# EAGLE design pc_heartypatch_v2 (EAGLE 6.6.0)
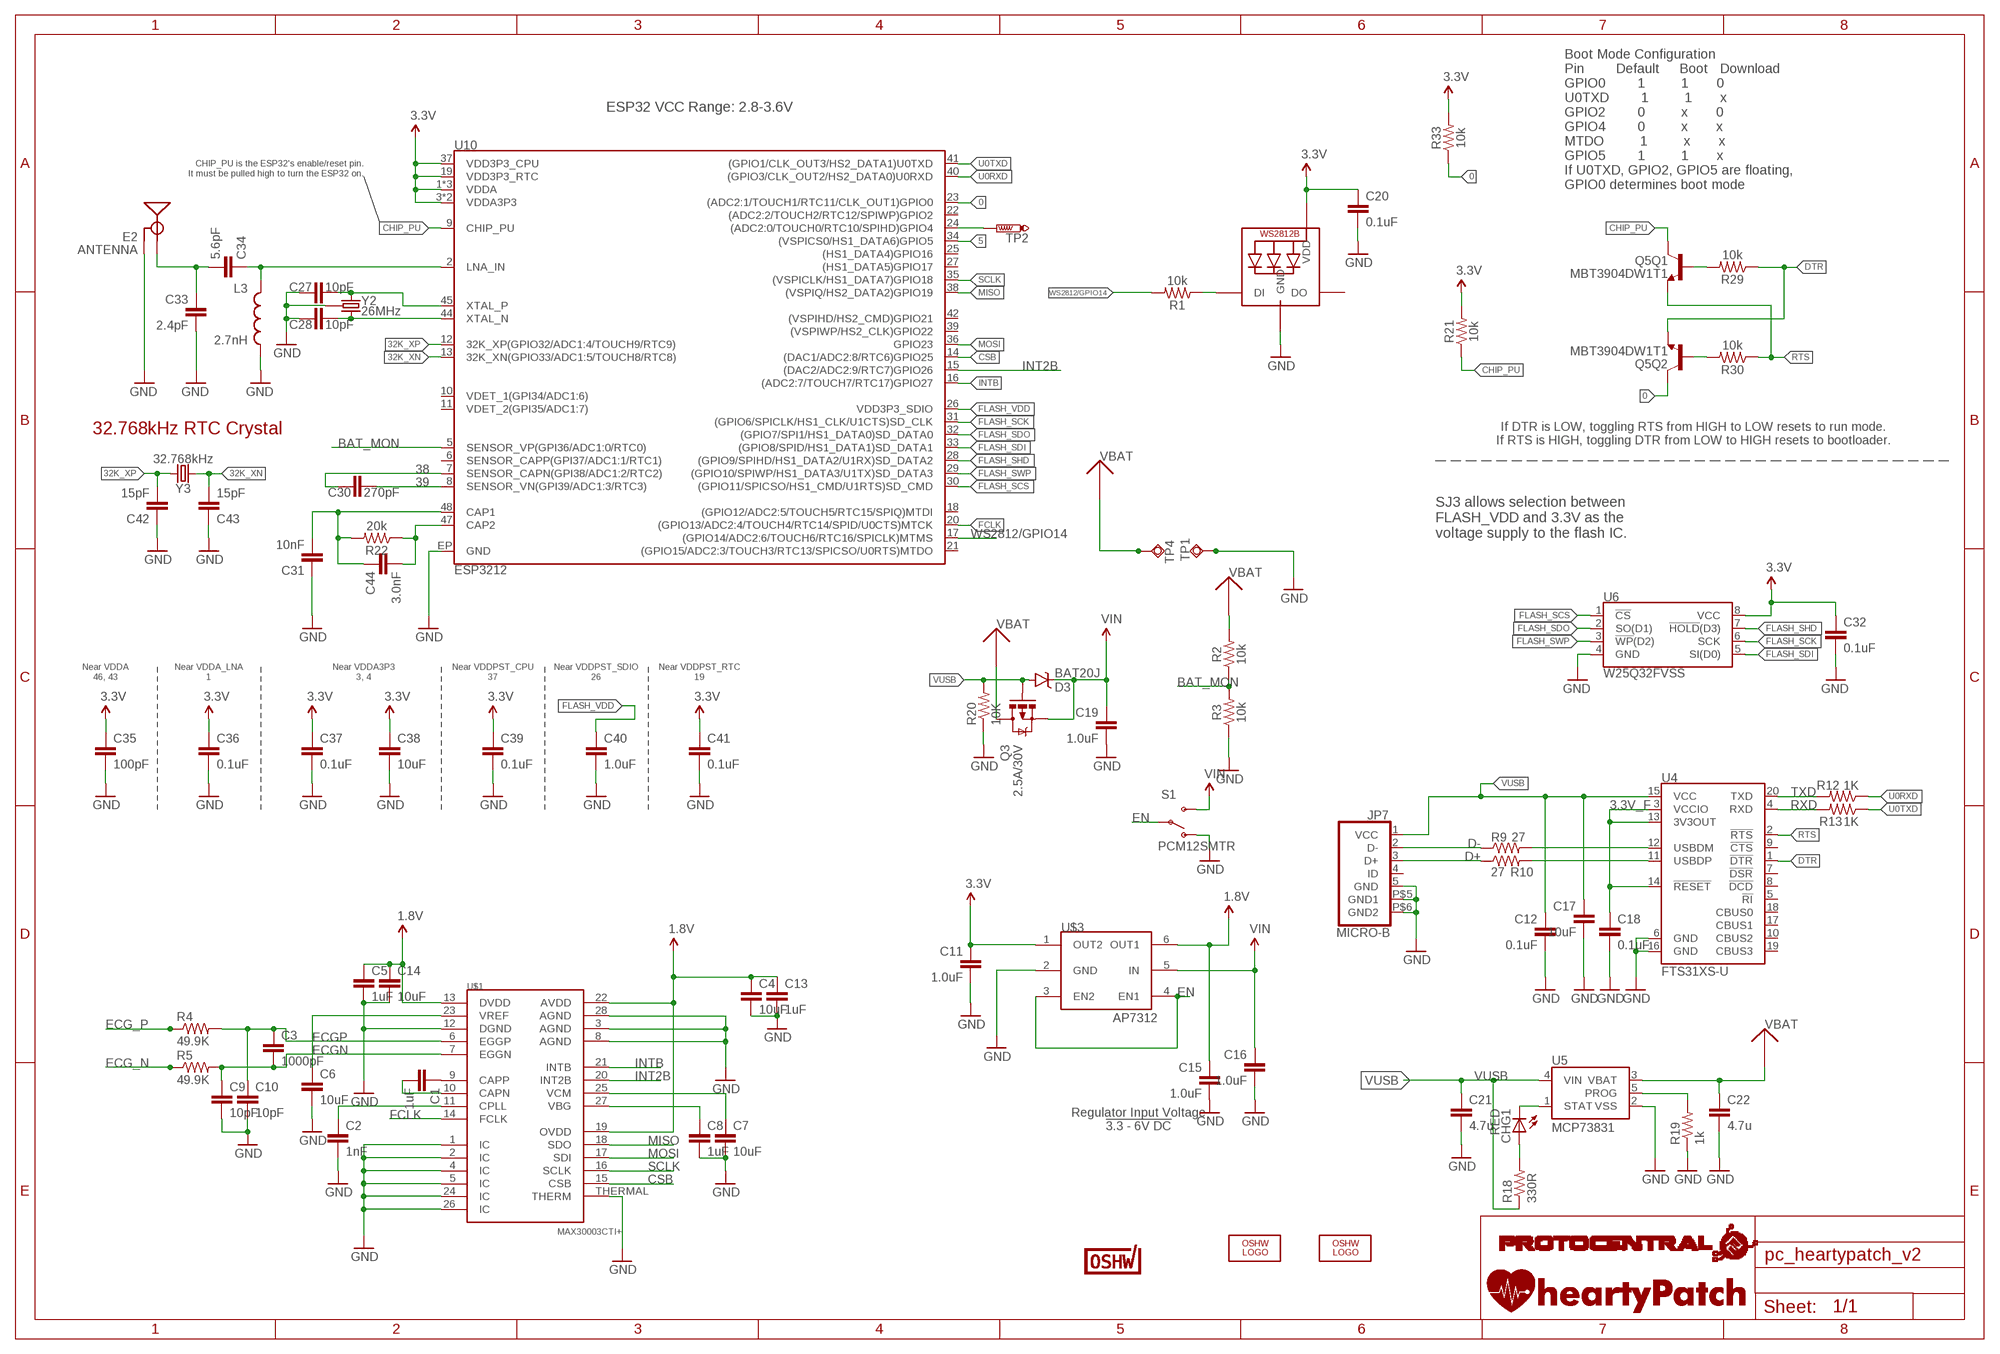
[diagram p0: schematic, sheet 1]

## Parts
C1  1uF  C-EUC0603  [C0603]
C2  1nF  C-EUC0603  [C0603]
C3  1000pF  C-EUC0402  [C0402]
C4  10uF  C-EUC0805  [C0805]
C5  1uF  C-EUC0402  [C0402]
C6  10uF  C-EUC0805  [C0805]
C7  10uF  C-EUC0805  [C0805]
C8  1uF  C-EUC0805  [C0805]
C9  10pF  C-EUC0402  [C0402]
C10  10pF  C-EUC0402  [C0402]
C11  1.0uF  1.0UF-0805-25V-10%  [0805]
C12  0.1uF  C-EUC0402  [C0402]
C13  1uF  C-EUC0805  [C0805]
C14  10uF  C-EUC0603  [C0603]
C15  1.0uF  1.0UF-0805-25V-10%  [0805]
C16  1.0uF  1.0UF-0805-25V-10%  [0805]
C17  10uF  C-EUC0805  [C0805]
C18  0.1uF  C-EUC0402  [C0402]
C19  1.0uF  C-EUC0402  [C0402]
C20  0.1uF  0.1UF-0603-25V-(+80/-20%)  [0603]
C21  4.7u  C-EUC0805  [C0805]
C22  4.7u  C-EUC0805  [C0805]
C27  10pF  10PF-0603-50V-5%  [0603]
C28  10pF  10PF-0603-50V-5%  [0603]
C30  270pF  270PF-50V-5%(0603)  [0603]
C31  10nF  10NF-0603-50V-10%  [0603]
C32  0.1uF  0.1UF-0402-16V-10%  [0402]
C33  2.4pF  2.4PF-0603-50V-5%  [0603]
C34  5.6pF  5.6PF-50V-5%(0603)  [0603]
C35  100pF  100PF-0603-50V-5%  [0603]
C36  0.1uF  0.1UF-0603-25V-(+80/-20%)  [0603]
C37  0.1uF  0.1UF-0603-25V-(+80/-20%)  [0603]
C38  10uF  10UF-0603-6.3V-20%  [0603]
C39  0.1uF  0.1UF-0402-16V-10%  [0402]
C40  1.0uF  1.0UF-0603-16V-10%  [0603]
C41  0.1uF  0.1UF-0603-25V-(+80/-20%)  [0603]
C42  15pF  15PF-0603-50V-5%  [0603]
C43  15pF  15PF-0603-50V-5%  [0603]
C44  3.0nF  3.0NF-0603-50V-5%  [0603]
CHG1  RED  LEDCHIPLED_0603  [CHIPLED_0603]
D3  BAT20J  DIODE-SCHOTTKY-BAT20J  [SOD-323]
E2  ANTENNA  ANTENNATRACE-TUNED  [TRACE_ANTENNA_2.4GHZ_25.7MM_TUNED]
JP7  MICRO-B  [MICRO-B]
L3  2.7nH  INDUCTOR0603  [0603]
LED1  WS2812B5050  [WS2812B]
LOGO1  OSHW_LOGO_FILLX0200-NT  [OSHW_FILLX200_NOTEXT]
LOGO2  OSHW_LOGO_FILLX0200-NT  [OSHW_FILLX200_NOTEXT]
Q3  2.5A/30V  MOSFET-PCHANNELDMG2307L  [SOT23-3]
Q5  MBT3904DW1T1  [SC70-6]
R1  10k  10KOHM-1/10W-1%(0603)0603  [0603]
R2  10k  10KOHM-1/10W-1%(0603)0603  [0603]
R3  10k  10KOHM-1/10W-1%(0603)0603  [0603]
R4  49.9K  RESISTOR0805-RES  [0805]
R5  49.9K  RESISTOR0805-RES  [0805]
R9  27  R-US_R0402  [R0402]
R10  27  R-US_R0402  [R0402]
R12  1K  R-US_R0402  [R0402]
R13  1K  R-US_R0402  [R0402]
R18  330R  R-US_R0402  [R0402]
R19  1k  R-US_R0402  [R0402]
R20  10K  R-US_R0402  [R0402]
R21  10k  10KOHM-1/10W-1%(0603)0603  [0603]
R22  20k  20KOHM-0603-1/10W-1%  [0603]
R29  10k  10KOHM-0603-1/10W-1%  [0603]
R30  10k  10KOHM-0603-1/10W-1%  [0603]
R33  10k  10KOHM-1/10W-1%(0603)0603  [0603]
S1  PCM12SMTR  SWITCH-SPDT-SMD-A  [SWITCH-SPST-SMD-A]
TP1  TPSQTP20SQ  [TP20SQ]
TP2  PTR1TP10SQ  [TP10SQ]
TP4  TPSQTP20SQ  [TP20SQ]
U4  FTS31XS-U  FT231XS  [SSOP20_L]
U5  MCP73831  [SOT23-5]
U6  W25Q32FVSS  [SOIC-8]
U10  ESP3212  [QFN48-0.4MM]
U$1  MAX30003CTI+  MAX30003  [QFN-28]
U$3  AP7312  [SOT26]
U$8  HEARTYPATCHHEART  [HEARTYPATCH]
U$9  PROTY_LOGO_WITH_TEXT  [PROTY_WITH_TEXT]
U$10  CERT-SMALL  [CERT-SMALL-SILK]
Y2  26MHz  CRYSTAL-GROUNDED3.2X2.5  [CRYSTAL-SMD-3.2X2.5]
Y3  32.768kHz  CRYSTAL-32.768KHZSMD-3.2X1.5  [CRYSTAL-SMD-3.2X1.5MM]

## Nets
0: Q5.6(Q2:C) R33.1 U10.23((ADC2:1/TOUCH1/RTC11/CLK_OUT1)GPIO0)
1.8V: C4.1 C5.1 C13.1 C14.1 C15.1 U$1.13(DVDD) U$1.19(OVDD) U$1.22(AVDD) U$3.6(OUT1)
3.3V: C11.1 C20.1 C32.1 C35.1 C36.1 C37.1 C38.1 C39.1 C41.1 LED1.1-VDD(VDD) R21.2 R33.2 U6.8(VCC) U10.1(VDDA) U10.3(VDDA3P3) U10.4(VDDA3P3) U10.19(VDD3P3_RTC) U10.37(VDD3P3_CPU) U10.43(VDDA) U10.46(VDDA) U$3.1(OUT2)
3.3V_F: C18.1 U4.3(VCCIO) U4.13(3V3OUT) U4.14(!RESET)
5: U10.34((VSPICS0/HS1_DATA6)GPIO5)
32K_XN: C43.2 U10.13(32K_XN(GPIO33/ADC1:5/TOUCH8/RTC8)) Y3.P$2
32K_XP: C42.2 U10.12(32K_XP(GPIO32/ADC1:4/TOUCH9/RTC9)) Y3.P$1
38: C30.1 U10.7(SENSOR_CAPN(GPI38/ADC1:2/RTC2))
39: C30.2 U10.8(SENSOR_VN(GPI39/ADC1:3/RTC3))
BAT_MON: R2.1 R3.2 U10.5(SENSOR_VP(GPI36/ADC1:0/RTC0))
CAP_10N: C31.2 C44.1 R22.2 U10.48(CAP1)
CHIP_PU: Q5.3(Q1:C) R21.1 U10.9(CHIP_PU)
CSB: U10.14((DAC1/ADC2:8/RTC6)GPIO25) U$1.15(CSB)
D+: JP7.3(D+) R10.1
D-: JP7.2(D-) R9.1
DTR: Q5.1(Q2:E) R29.1 U4.1(!DTR)
ECG_N: R5.1
ECG_P: R4.1
ECGN: C3.2 C9.1 R5.2 U$1.7(EGGN)
ECGP: C3.1 C10.1 R4.2 U$1.6(EGGP)
EN: S1.2(P) U$3.3(EN2) U$3.4(EN1)
FCLK: U10.20((GPIO13/ADC2:4/TOUCH4/RTC14/SPID/U0CTS)MTCK) U$1.14(FCLK)
FLASH_SCK: U6.6(SCK) U10.31((GPIO6/SPICLK/HS1_CLK/U1CTS)SD_CLK)
FLASH_SCS: U6.1(!CS!) U10.30((GPIO11/SPICSO/HS1_CMD/U1RTS)SD_CMD)
FLASH_SDI: U6.5(SI(D0)) U10.33((GPIO8/SPID/HS1_DATA1)SD_DATA1)
FLASH_SDO: U6.2(SO(D1)) U10.32((GPIO7/SPI1/HS1_DATA0)SD_DATA0)
FLASH_SHD: U6.7(!HOLD!(D3)) U10.28((GPIO9/SPIHD/HS1_DATA2/U1RX)SD_DATA2)
FLASH_SWP: U6.3(!WP!(D2)) U10.29((GPIO10/SPIWP/HS1_DATA3/U1TX)SD_DATA3)
FLASH_VDD: C40.1 U10.26(VDD3P3_SDIO)
GND: C2.2 C4.2 C5.2 C6.2 C7.2 C8.2 C9.2 C10.2 C11.2 C12.2 C13.2 C14.2 C15.2 C16.2 C17.2 C18.2 C19.2 C20.2 C21.2 C22.2 C27.1 C28.1 C31.1 C32.2 C33.2 C35.2 C36.2 C37.2 C38.2 C39.2 C40.2 C41.2 C42.1 C43.1 E2.GND E2.GND2(GND) JP7.5(GND) JP7.P$5(GND1) JP7.P$6(GND2) L3.2 LED1.3-GND(GND) R3.1 R19.1 R20.1 S1.1(O) TP1.TP U4.6(GND) U4.16(GND) U5.2(VSS) U6.4(GND) U10.EP(GND) U$1.1(IC) U$1.2(IC) U$1.3(AGND) U$1.4(IC) U$1.5(IC) U$1.8(AGND) U$1.12(DGND) U$1.24(IC) U$1.26(IC) U$1.28(AGND) U$1.THERMAL(THERM) U$3.2(GND) Y2.2(GND) Y2.4(GND)
INT2B: U10.15((DAC2/ADC2:9/RTC7)GPIO26) U$1.20(INT2B)
INTB: U10.16((ADC2:7/TOUCH7/RTC17)GPIO27) U$1.21(INTB)
LNA_IN: C34.1 L3.1 U10.2(LNA_IN)
MISO: U10.38((VSPIQ/HS2_DATA2)GPIO19) U$1.18(SDO)
MOSI: U10.36(GPIO23) U$1.17(SDI)
N$1: LED1.4-DIN(DI) R1.1
N$2: C6.1 U$1.23(VREF)
N$3: C1.1 U$1.9(CAPP)
N$4: TP2.TP U10.24((ADC2:0/TOUCH0/RTC10/SPIHD)GPIO4)
N$5: CHG1.C U5.1(STAT)
N$6: C1.2 U$1.10(CAPN)
N$7: C2.1 U$1.11(CPLL)
N$9: R9.2 U4.12(USBDM)
N$11: R10.2 U4.11(USBDP)
N$13: C7.1 U$1.25(VCM)
N$14: C8.1 U$1.27(VBG)
N$16: CHG1.A R18.2
N$19: R19.2 U5.5(PROG)
N$23: Q5.5(Q1:B) R29.2
N$24: Q5.2(Q2:B) R30.2
N$25: C27.2 U10.45(XTAL_P) Y2.1
N$26: C28.2 U10.44(XTAL_N) Y2.3
N$30: C44.2 R22.1 U10.47(CAP2)
RTS: Q5.4(Q1:E) R30.1 U4.2(!RTS)
RXD: R13.2 U4.4(RXD)
SCLK: U10.35((VSPICLK/HS1_DATA7)GPIO18) U$1.16(SCLK)
TRACE_ANT1: C33.1 C34.2 E2.ANT(SIGNAL)
TXD: R12.2 U4.20(TXD)
U0RXD: R12.1 U10.40((GPIO3/CLK_OUT2/HS2_DATA0)U0RXD)
U0TXD: R13.1 U10.41((GPIO1/CLK_OUT3/HS2_DATA1)U0TXD)
VBAT: C22.1 Q3.3(D) R2.2 TP4.TP U5.3(VBAT)
VIN: C16.1 C19.1 D3.C Q3.2(S) S1.3(S) U$3.5(IN)
VUSB: C12.1 C17.1 C21.1 D3.A JP7.1(VCC) Q3.1(G) R18.1 R20.2 U4.15(VCC) U5.4(VIN)
WS2812/GPIO14: R1.2 U10.17((GPIO14/ADC2:6/TOUCH6/RTC16/SPICLK)MTMS)
Unconnected: JP7.4(ID) LED1.2-DOUT(DO) U4.5(!RI) U4.7(!DSR) U4.8(!DCD) U4.9(!CTS) U4.10(CBUS2) U4.17(CBUS1) U4.18(CBUS0) U4.19(CBUS3) U10.6(SENSOR_CAPP(GPI37/ADC1:1/RTC1)) U10.10(VDET_1(GPI34/ADC1:6)) U10.11(VDET_2(GPI35/ADC1:7)) U10.18((GPIO12/ADC2:5/TOUCH5/RTC15/SPIQ)MTDI) U10.21((GPIO15/ADC2:3/TOUCH3/RTC13/SPICSO/U0RTS)MTDO) U10.22((ADC2:2/TOUCH2/RTC12/SPIWP)GPIO2) U10.25((HS1_DATA4)GPIO16) U10.27((HS1_DATA5)GPIO17) U10.39((VSPIWP/HS2_CLK)GPIO22) U10.42((VSPIHD/HS2_CMD)GPIO21)

## Notes on the sheet
- ESP32 VCC Range: 2.8-3.6V
- CHIP_PU is the ESP32's enable/reset pin.
  It must be pulled high to turn the ESP32 on.
- Boot Mode Configuration
  Pin        Default     Boot   Download
  GPIO0        1         1       0
  U0TXD        1         1       x
  GPIO2        0         x       0
  GPIO4        0         x       x
  MTDO         1         x       x
  GPIO5        1         1       x
  If U0TXD, GPIO2, GPIO5 are floating, 
  GPIO0 determines boot mode
- 32.768kHz RTC Crystal
- If DTR is LOW, toggling RTS from HIGH to LOW resets to run mode.
  If RTS is HIGH, toggling DTR from LOW to HIGH resets to bootloader.
- SJ3 allows selection between 
  FLASH_VDD and 3.3V as the
  voltage supply to the flash IC.
- Near VDDA
  46, 43
- Near VDDA_LNA
  1
- Near VDDA3P3
  3, 4
- Near VDDPST_CPU
  37
- Near VDDPST_SDIO
  26
- Near VDDPST_RTC
  19
- Regulator Input Voltage
  !3.3 - 6V DC!

## Library data of the parts
C1-C10 C12-C14 C17-C19 C21 C22 = rcl:C-EU: CAPACITOR, European symbol
C11 C15 C16 = SparkFun-Capacitors:1.0UF: 1µF ceramic capacitors A capacitor is a passive two-terminal electrical component used to store electrical energy temporarily in an electric field.; PROD_ID: CAP-08064
C20 C36 C37 C41 = SparkFun-Capacitors:0.1UF: 0.1µF ceramic capacitors A capacitor is a passive two-terminal electrical component used to store electrical energy temporarily in an electric field.; PROD_ID: CAP-00810
C27 C28 = SparkFun-Capacitors:10PF: 10pF ceramic capacitors A capacitor is a passive two-terminal electrical component used to store electrical energy temporarily in an electric field.; PROD_ID: CAP-11812
C30 = esp32-thing-temp:270PF-50V-5%(0603): CAP-13339; PROD_ID: CAP-13339
C31 = SparkFun-Capacitors:10NF: 0.01uF/10nF/10,000pF ceramic capacitors A capacitor is a passive two-terminal electrical component used to store electrical energy temporarily in an electric field. CAP-09321; PROD_ID: CAP-00867
C32 C39 = SparkFun-Capacitors:0.1UF: 0.1µF ceramic capacitors A capacitor is a passive two-terminal electrical component used to store electrical energy temporarily in an electric field.; PROD_ID: CAP-12416
C33 = esp32-thing-temp:2.4PF: 2.4pF ceramic capacitors A capacitor is a passive two-terminal electrical component used to store electrical energy temporarily in an electric field.; PROD_ID: CAP-13541
C34 = esp32-thing-temp:5.6PF-50V-5%(0603): CAP-12456; PROD_ID: CAP-12456
C35 = SparkFun-Capacitors:100PF: 100pF/0.1nF ceramic capacitors A capacitor is a passive two-terminal electrical component used to store electrical energy temporarily in an electric field.; PROD_ID: CAP-07883
C38 = SparkFun-Capacitors:10UF: 10.0µF ceramic capacitors A capacitor is a passive two-terminal electrical component used to store electrical energy temporarily in an electric field.; PROD_ID: CAP-11015
C40 = SparkFun-Capacitors:1.0UF: 1µF ceramic capacitors A capacitor is a passive two-terminal electrical component used to store electrical energy temporarily in an electric field.; PROD_ID: CAP-00868
C42 C43 = SparkFun-Capacitors:15PF: 15pF ceramic capacitors A capacitor is a passive two-terminal electrical component used to store electrical energy temporarily in an electric field.; PROD_ID: CAP-07881
C44 = esp32-thing-temp:3.0NF: 3.0nF (3nF, 3000pF) ceramic capacitors A capacitor is a passive two-terminal electrical component used to store electrical energy temporarily in an electric field.; PROD_ID: CAP-13515
CHG1 = led:LED: LED OSRAM: - CHIPLED LG R971, LG N971, LY N971, LG Q971, LY Q971, LO R971, LY R971 LH N974, LH R974 LS Q976, LO Q976, LY Q976 LO Q996 - Hyper CHIPLED LW Q18S LB Q993, LB Q99A, LB R99A - SideLED LS A670, LO A670, LY A670, LG A670, LP A670 LB A673, LV A673, LT A673, LW A673 LH A674 LY A675 LS A676, LA A676, LO A676, LY A676, LW A676 LS A679, LY A679, LG A679 - Hyper Micro SIDELED® LS Y876, LA Y876, LO Y876, LY Y876 LT Y87S - SmartLED LW L88C, LW L88S LB L89C, LB L89S, LG L890 LS L89K, LO L89K, LY L89K LS L896, LA L896, LO L896, LY L896 - TOPLED LS T670, LO T670, LY T670, LG T670, LP T670 LSG T670, LSP T670, LSY T670, LOP T670, LYG T670 LG T671, LOG T671, LSG T671 LB T673, LV T673, LT T673, LW T673 LH T674 LS T676, LA T676, LO T676, LY T676, LB T676, LH T676, LSB T676, LW T676 LB T67C, LV T67C, LT T67C, LS T67K, LO T67K, LY T67K, LW E67C LS E67B, LA E67B, LO E67B, LY E67B, LB E67C, LV E67C, LT E67C LW T67C LS T679, LY T679, LG T679 LS T770, LO T770, LY T770, LG T770, LP T770 LB T773, LV T773, LT T773, LW T773 LH T774 LS E675, LA E675, LY E675, LS T675 LS T776, LA T776, LO T776, LY T776, LB T776 LHGB T686 LT T68C, LB T68C - Hyper Mini TOPLED® LB M676 - Mini TOPLED Santana® LG M470 LS M47K, LO M47K, LY M47K Source: http://www.osram.convergy.de LUXEON: - LUMILED® LXK2-PW12-R00, LXK2-PW12-S00, LXK2-PW14-U00, LXK2-PW14-V00 LXK2-PM12-R00, LXK2-PM12-S00, LXK2-PM14-U00 LXK2-PE12-Q00, LXK2-PE12-R00, LXK2-PE12-S00, LXK2-PE14-T00, LXK2-PE14-U00 LXK2-PB12-K00, LXK2-PB12-L00, LXK2-PB12-M00, LXK2-PB14-N00, LXK2-PB14-P00, LXK2-PB14-Q00 LXK2-PR12-L00, LXK2-PR12-M00, LXK2-PR14-Q00, LXK2-PR14-R00 LXK2-PD12-Q00, LXK2-PD12-R00, LXK2-PD12-S00 LXK2-PH12-R00, LXK2-PH12-S00 LXK2-PL12-P00, LXK2-PL12-Q00, LXK2-PL12-R00 Source: www.luxeon.com KINGBRIGHT: KA-3528ASYC Source: www.kingbright.com
D3 = SparkFun-DiscreteSemi:DIODE-SCHOTTKY: Schottky diodes in SFE's production catalog BAT20J 1A 23V 0.62Vf RB751 120mA 40V 0.37Vf PMEG4005EJ 0.5A 40V 0.42Vf MBRA140 1A 40V 0.5Vf B340A 3A 40V SMA; PROD_ID: DIO-11623
E2 = esp32-thing-temp:ANTENNA: Chip antenna Chip antenna with ground or secondary connection. Common with larger metal RF connectors.
JP7 = circuitects:MICRO-B
L3 = SparkFun-Passives:INDUCTOR: Inductors Basic Inductor/Choke - 0603 and 1206. Footprints are not proven and vary greatly between part numbers. INDUCTOR POWER 3.3UH 4.0A SMD 0.197" L x 0.197" W x 0.177" H (5.00mm x 5.00mm x 4.50mm); PROD_ID: NDUC-08762
LED1 = adafruit:WS2812B
LOGO1 LOGO2 = ohw-logo:OSHW_LOGO_FILL
Q3 = SparkFun-DiscreteSemi:MOSFET-PCHANNEL: Generic PMOSFET IRLML2244 - TRANS-11153 (SOT-23 -20V -4.3A) (1.Gate 2.Source 3.Drain) FQP27P06 - COM-10349 <http://www.sparkfun.com/products/10349> (TO-220 -60V -27A) (1.Gate 2.Source 3.Drain); PROD_ID: TRANS-11308
Q5 = esp32-thing-temp:MBT3904DW1T1: MBT3904DW1 Dual NPN Transistors The MBT3904W1 puts two general purpose 3904 NPN transistors in a single package. Datasheet <http://www.onsemi.com/pub_link/Collateral/MBT3904DW1T1-D.PDF>; PROD_ID: TRANS-13337
R1-R3 R21 R33 = SparkFun-Resistors:10KOHM-1/10W-1%(0603): RES-00824; PROD_ID: RES-00824; VALUE: 10K
R4 R5 = SparkFun:RESISTOR: Resistor Basic schematic elements and footprints for 0603, 1206, and PTH resistors.
R9 R10 R12 R13 R18-R20 = rcl:R-US_: RESISTOR, American symbol
R22 = SparkFun-Resistors:20KOHM: 20kΩ resistor A resistor is a passive two-terminal electrical component that implements electrical resistance as a circuit element. Resistors act to reduce current flow, and, at the same time, act to lower voltage levels within circuits. - Wikipedia; PROD_ID: RES-09383
R29 R30 = SparkFun-Resistors:10KOHM: 10kΩ resistor A resistor is a passive two-terminal electrical component that implements electrical resistance as a circuit element. Resistors act to reduce current flow, and, at the same time, act to lower voltage levels within circuits. - Wikipedia; PROD_ID: RES-00824
S1 = SparkFun-Electromechanical:SWITCH-SPDT: SPDT Switch Simple slide switch, Spark Fun Electronics SKU : COM-00102 DPDT SMT slide switch, AYZ0202, SWCH-08179; PROD_ID: SWCH-10651
TP1 TP4 = testpad:TPSQ: Test pad
TP2 = testpad:PTR1: TEST PIN
U4 = SparkFun-DigitalIC:FT231X: FTDI FT231X Full Speed USB to Full-handshake UART This USB2.0 Full Speed IC offers a compact bridge to full handshake UART interfaces. The device is a UART, capable of operating up to 3MBaud, with low power consumption (8mA). The FT231X includes the complete FT-X series feature set and enables USB to be added into a system design quickly and easily over a UART interface.; PROD_ID: IC-11524; VALUE: FT231XS
U5 = SparkFun:MCP73831: Microchip's MCP73831 Miniature single cell, fully integrated Li-Ion, Li-polymer charge management controller http://ww1.microchip.com/downloads/en/DeviceDoc/21984a.pdf
U6 = SparkFun-DigitalIC:W25Q32FV: Winbond W25Q32FV 32Mbit (4MB) Flash The W25Q32FV support the standard Serial Peripheral Interface (SPI), Dual/Quad I/O SPI as well as 2-clocks instruction cycle Quad Peripheral Interface (QPI). Datasheet <http://www.winbond.com/resource-files/w25q32fv%20revh%20091613.pdf>; PROD_ID: IC-13229
U10 = esp32-thing-temp:ESP3212; PROD_ID: IC-13338
U$1 = circuitects:MAX30003
U$3 = circuitects:AP7312
U$8 = circuitects:HEARTYPATCH
U$9 = circuitects:PROTY_LOGO_WITH_TEXT
U$10 = OSHWA:CERT
Y2 = things:CRYSTAL-GROUNDED; PROD_ID: XTAL-12454
Y3 = SparkFun-Clocks:CRYSTAL-32.768KHZ: 32.768kHz Crystal Frequency: 32.768kHz Frequency Stability: ±20ppm Load Capacitance: 12.5pF (PTH-2X6 & SMD-3.2X1.5), 6pF (SMD-2X6); PROD_ID: XTAL-13062

## Net classes
2 gnd: width 0.254 mm, drill 0.254 mm, clearance 0.178 mm

## Board
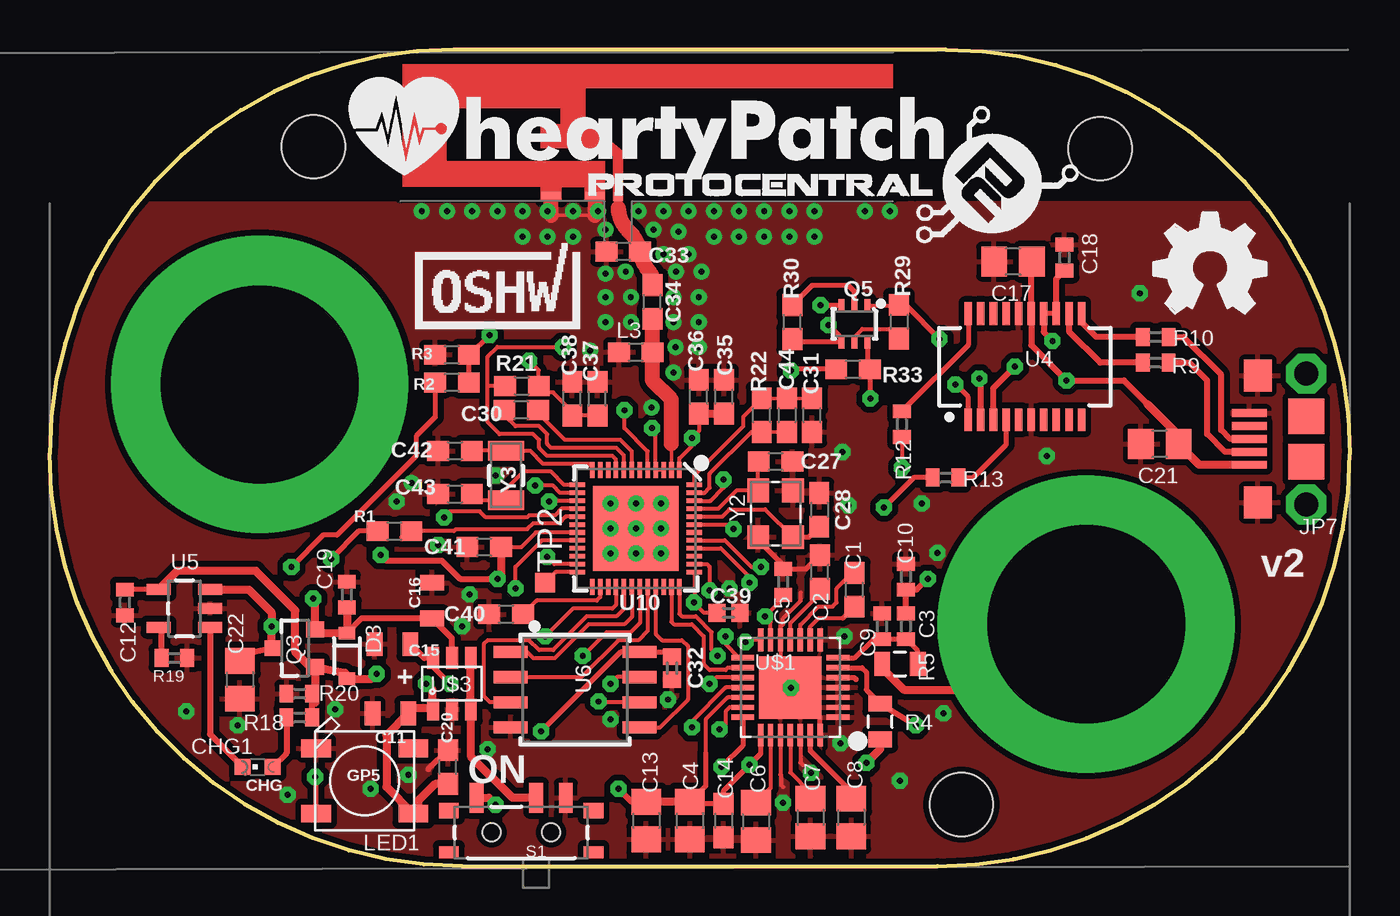
[diagram p1: board, top side]
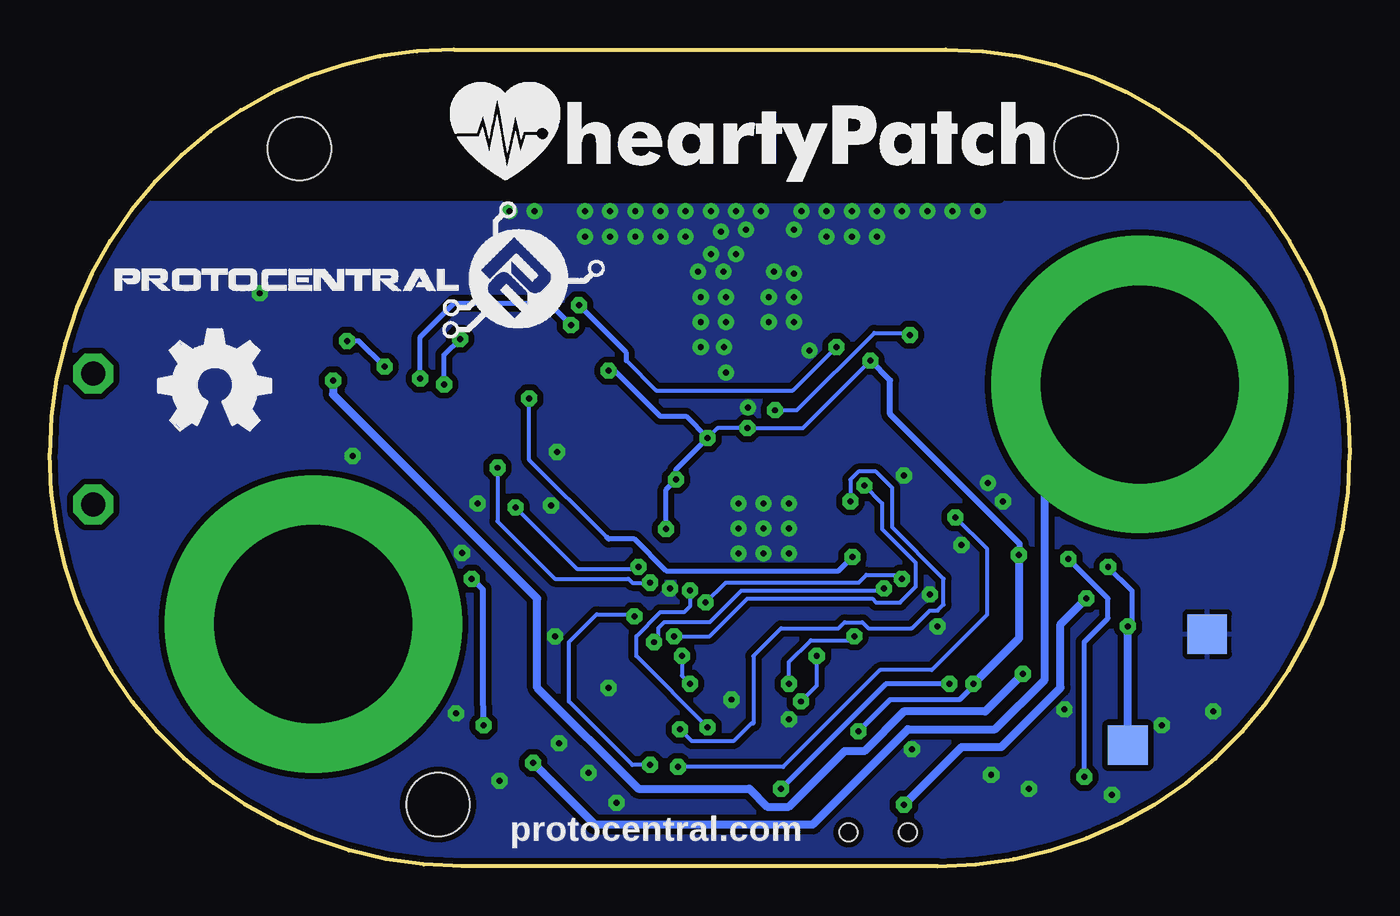
[diagram p2: board, bottom side, seen from below]

Size 65.6 x 41.2 mm. Coordinates in mm from the lower left corner, seen from the top.
Outline: 45.2,41.2 20.4,41.2 arc90 0,20.8 arc90 20.8,0 44.8,0 arc90 65.6,20.8 arc90 45.2,41.2
Copper layers (1*2*15*16): Top 0.035mm / dielectric 1.5mm / Route2 0.035mm / dielectric 0.15mm / Route15 0.035mm / dielectric 0.2mm / Bottom 0.035mm
Design rules "Circuitects-Rules": minimum track width 6mil, minimum drill 0.3mm, track to track 6mil, track to pad 6mil, pad to pad 6mil, via to via 6mil, smd to smd 6mil, copper to edge 10mil, drill to drill 8mil, minimum pad ring 12mil, minimum via ring 10mil, stop-mask expansion 4mil, vias tented up to drill 25mil, thermal gap 10mil
Holes 3.2 mm at 46,3.1 13.3,36.3 53,36.2

### Footprints (pad centres in the part's own frame; a part is rotated, then mirrored left to right if it is on the bottom)
C0603 = smd 1.1 x 1: 1 -0.85,0; 2 0.85,0
C0402 = smd 0.7 x 0.9: 1 -0.65,0; 2 0.65,0
C0805 = smd 1.3 x 1.5: 1 -0.95,0; 2 0.95,0
0805 = smd 0.8 x 1.2: 1 -0.9,0; 2 0.9,0
0603 = smd 1.1 x 1: 1 -0.85,0; 2 0.85,0
0402 = smd 0.85 x 0.9: 1 -0.58,0; 2 0.58,0
CHIPLED_0603 = smd 0.8 x 0.8: A 0,-0.75; C 0,0.75
SOD-323 = smd 0.63 x 0.83: A 1.15,0; C -1.15,0
TRACE_ANTENNA_2.4GHZ_25.7MM_TUNED = smd 0.46 x 0.46: ANT 0,0.23 | smd 1 x 0.46: GND -1.18,0.23; GND2 -3.38,0.23
MICRO-B = smd 0.4 x 1.75: 1 -1.25,2.975; 2 -0.6,2.975; 3 0.05,2.975; 4 0.7,2.975; 5 1.35,2.975 | smd 1.8 x 1.8: P$1 -1.1,0.1; P$2 1.2,0.1 | drill 1.2 pad 2 octagon: P$3 -3.25,0.1; P$4 3.35,0.1 | smd 1.6 x 1.4: P$5 -3.15,2.55; P$6 3.25,2.55
WS2812B = smd 1.5 x 0.9: 1-VDD 2.45,-1.65; 2-DOUT 2.45,1.65; 3-GND -2.45,1.65; 4-DIN -2.45,-1.65
SOT23-3 = smd 0.8 x 0.9: 1 -0.95,-1; 2 0.95,-1; 3 0,1.1
SC70-6 = smd 0.3 x 0.66: 1 -0.65,-0.92; 2 0,-0.92; 3 0.65,-0.92; 4 0.65,0.92; 5 0,0.92; 6 -0.65,0.92
R0402 = smd 0.7 x 0.9: 1 -0.65,0; 2 0.65,0
SWITCH-SPST-SMD-A = smd 0.7 x 1.5: 1 -2.25,-1.75; 2 -0.75,-1.75; 3 2.25,-1.75 | smd 1 x 0.6: GND1 -3.65,1; GND3 3.65,1 | smd 1 x 0.8: GND2 -3.65,-1.1; GND4 3.65,-1.1 | hole 0.9: -1.5,0; 1.5,0
TP20SQ = smd 2 x 2: TP 0,0
TP10SQ = smd 1 x 1: TP 0,0
SSOP20_L = smd 0.381 x 1.143: 1 -2.857,-2.68; 2 -2.223,-2.68; 3 -1.587,-2.68; 4 -0.953,-2.68; 5 -0.318,-2.68; 6 0.318,-2.68; 7 0.953,-2.68; 8 1.587,-2.68; 9 2.223,-2.68; 10 2.857,-2.68; 11 2.857,2.68; 12 2.223,2.68; 13 1.587,2.68; 14 0.953,2.68; 15 0.318,2.68; 16 -0.318,2.68; 17 -0.953,2.68; 18 -1.587,2.68; 19 -2.223,2.68; 20 -2.857,2.68
SOT23-5 = smd 0.55 x 1.2: 1 -0.95,-1.3; 2 0,-1.3; 3 0.95,-1.3; 4 0.95,1.3; 5 -0.95,1.3
SOIC-8 = smd 0.61 x 1.702: 1 -1.905,-3.251; 2 -0.635,-3.251; 3 0.635,-3.251; 4 1.905,-3.251; 5 1.905,3.251; 6 0.635,3.251; 7 -0.635,3.251; 8 -1.905,3.251
QFN48-0.4MM = smd 0.8 x 0.23: 1 -2.95,2.2; 2 -2.95,1.8; 3 -2.95,1.4; 4 -2.95,1; 5 -2.95,0.6; 6 -2.95,0.2; 7 -2.95,-0.2; 8 -2.95,-0.6; 9 -2.95,-1; 10 -2.95,-1.4; 11 -2.95,-1.8; 12 -2.95,-2.2; 25 2.95,-2.2; 26 2.95,-1.8; 27 2.95,-1.4; 28 2.95,-1; 29 2.95,-0.6; 30 2.95,-0.2; 31 2.95,0.2; 32 2.95,0.6; 33 2.95,1; 34 2.95,1.4; 35 2.95,1.8; 36 2.95,2.2 | smd 0.23 x 0.8: 13 -2.2,-2.95; 14 -1.8,-2.95; 15 -1.4,-2.95; 16 -1,-2.95; 17 -0.6,-2.95; 18 -0.2,-2.95; 19 0.2,-2.95; 20 0.6,-2.95; 21 1,-2.95; 22 1.4,-2.95; 23 1.8,-2.95; 24 2.2,-2.95; 37 2.2,2.95; 38 1.8,2.95; 39 1.4,2.95; 40 1,2.95; 41 0.6,2.95; 42 0.2,2.95; 43 -0.2,2.95; 44 -0.6,2.95; 45 -1,2.95; 46 -1.4,2.95; 47 -1.8,2.95; 48 -2.2,2.95 | smd 4.3 x 4.3: EP 0,0
QFN-28 = smd 1.15 x 0.27: 1 -2.4,1.5; 2 -2.4,1; 3 -2.4,0.5; 4 -2.4,0; 5 -2.4,-0.5; 6 -2.4,-1; 7 -2.4,-1.5; 15 2.4,-1.5; 16 2.4,-1; 17 2.4,-0.5; 18 2.4,0; 19 2.4,0.5; 20 2.4,1; 21 2.4,1.5 | smd 0.27 x 1.15: 8 -1.5,-2.4; 9 -1,-2.4; 10 -0.5,-2.4; 11 0,-2.4; 12 0.5,-2.4; 13 1,-2.4; 14 1.5,-2.4; 22 1.5,2.4; 23 1,2.4; 24 0.5,2.4; 25 0,2.4; 26 -0.5,2.4; 27 -1,2.4; 28 -1.5,2.4 | smd 3.15 x 3.15: THERMAL 0,0
SOT26 = smd 0.6 x 1.1: 1 -0.95,-1.3; 2 0,-1.3; 3 0.95,-1.3; 4 0.95,1.3; 5 0,1.3; 6 -0.95,1.3
CRYSTAL-SMD-3.2X2.5 = smd 1.2 x 1.1: 1 -1.175,-0.875; 2 1.175,-0.875; 3 1.175,0.875; 4 -1.175,0.875
CRYSTAL-SMD-3.2X1.5MM = smd 1 x 1.8: P$1 -1.25,0; P$2 1.25,0

### Placement (x,y rotation side)
C1  40.61,13.94 90 top
C2  38.86,14.84 90 top
C3  43.2,12.1 270 top
C4  32.3,2.3 270 top
C5  37.01,14.34 90 top
C6  35.64,2.26 270 top
C7  38.39,2.46 270 top
C8  40.44,2.46 270 top
C9  42,12.1 90 top
C10  43.2,14.6 90 top
C11  17.2,7.7 180 top
C12  3.8,13.3 270 top
C13  30.1,2.3 270 top
C14  34,2.3 270 top
C15  17.3,11.2 180 top
C16  19.3,13.4 90 top
C17  48.6,30.5 180 top
C18  51.2,30.7 90 top
C19  15,13.7 90 top
C20  20.1,5 90 top
C21  56,21.3 180 top
C22  9.6,9.4 270 top
C27  36.62,20.41 180 top
C28  38.83,17.97 270 top
C30  23.79,23.01 180 top
C31  38.47,22.75 90 top
C32  31.4,9.99 270 top
C33  28.94,31 180 top
C34  30.41,28.46 90 top
C35  34.02,23.68 90 top
C36  32.75,23.68 90 top
C37  27.64,23.59 90 top
C38  26.37,23.59 90 top
C39  34.24,12.78 0 top
C40  23.03,12.71 180 top
C41  21.93,16.1 180 top
C42  20.45,20.95 0 top
C43  20.45,18.77 0 top
C44  37.2,22.75 270 top
CHG1  10.5,5 90 top
D3  15,10.6 270 top
E2  28.69,33.55 0 top
JP7  63.5,21.5 90 top
L3  29.58,25.93 180 top
LED1  15.9,4.3 0 top
LOGO1  55.7,27.9 0 top
LOGO2  60.1,22 0 bottom
Q3  12.4,11 90 top
Q5  40.6,27.36 180 top
R1  17.4,16.9 0 top
R2  20.3,24.4 180 top
R3  20.3,25.8 0 top
R4  41.9,7.3 90 top
R5  42.9,10.2 0 top
R9  55.8,25.4 180 top
R10  55.8,26.7 180 top
R12  43,22.3 90 top
R13  45.2,19.6 0 top
R18  12.6,7.5 180 top
R19  6.3,10.5 180 top
R20  12.6,8.7 0 top
R21  23.83,24.22 0 top
R22  35.93,22.75 90 top
R29  42.85,27.47 270 top
R30  37.47,27.45 90 top
R33  40.53,25.07 180 top
S1  23.79,1.7 180 top
TP1  7.2,11.7 0 bottom
TP2  25,14.3 0 top
TP4  11.2,6.1 0 bottom
U4  49.2,25.2 0 top
U5  6.8,13 90 top
U6  26.51,8.9 270 top
U10  29.58,17.04 270 top
U$1  37.37,9.01 180 top
U$3  20.3,9.2 0 top
U$4  HEARTYPATCHHEART  [HEARTYPATCH]  45.4,34.55 0 bottom
U$7  PROTY_LOGO_WITH_TEXT  [PROTY_WITH_TEXT]  27.2,31.8 0 top
U$8  15.1,34.8 0 top
U$9  62.3,27 0 bottom
U$10  22.6,27.1 0 top
Y2  36.62,17.77 270 top
Y3  23.02,19.71 270 top

### Tracks (layer width: path | path; a pad name or v marks a point on that pad's centre or on a via)
0  (via drill 0.3)
  Top 0.2: U10.23 25.47,15.23 v25.1,15.6
  Top 0.254: Q5.6 41.25,25.2 R33.1 41.38,23.62 v41.4,23.6
  Bottom 0.2: 37.5,16.6 41.4,20.5 v41.4,23.6
  Bottom 0.254: v25.1,15.6 25.8,14.9 34.5,14.9 36.1,16.5 37.4,16.5 37.5,16.6
1.8V  (via drill 0.3)
  Top 0.2: U$1.19 34.21,8.51 33.1,7.4 33.1,5.71 | U$1.13 36.37,12.33 v36.1,12.6 37.01,13.51 C5.1
  Top 0.254: 33.1,5.71 33.1,4.05 C4.1 32.4,3.15 C14.1 34,3.8 v35.3,5.1 35.87,5.67 U$1.22 | U$3.6 19.35,10.05 v20.2,9.2
  Top 0.305: C13.1 29.35,3.25 v28.7,3.9 | U$3.6 18.9,10.5 C15.1
  Top 0.406: C4.1 C13.1
  Bottom 0.2: v35.3,5.1 36.2,5.1 39.4,8.3 39.4,11.3 38,12.7 36.2,12.7 v36.1,12.6
  Bottom 0.254: v28.7,3.9 23.4,9.2 v20.2,9.2
3.3V  (via drill 0.3)
  Top 0.2: U10.1 31.77,20.57 32.4,21.2 v32.4,21.6 32.75,21.95 C36.1 | U10.3 U10.4 30.58,21.93 v30.4,22.1 | U10.37 32.52,13.32 v32.5,13.3 33.02,12.78 C39.1 | 22.88,16.2 C41.1 23.8,16.1 24.54,16.84 U10.19 | U10.46 33.34,18.43 34,19.1 v34,19.5 | U10.43 34.27,17.23 v34.5,17 | C37.1 C38.1 26.37,22.93 25.4,23.9 25,23.9 R21.2 24.68,25.02 v24.2,25.5
  Top 0.254: R33.2 37.47,25.07 v37.4,25 | C32.1 31.16,10.8 U6.8 28.8,10.8 v24.8,6.8
  Top 0.305: v22.6,14.5 20.7,14.5 19.8,15.4 17,15.4 v16.7,15.7
  Top 0.406: C36.1 C35.1 | C41.1 22.77,14.67 v22.6,14.5 | v19,9.2 19.3,8.9 19.3,7.95 | 19.3,7.95 U$3.1 | C20.1 19.45,4.15 18.6,3.3 18.6,2.9 LED1.1-VDD 17,4 17,6.6 C11.1 18.35,7.95 19.3,7.95
  Bottom 0.2: v32.4,21.6 31.9,22.1 v30.4,22.1 27.6,22.1 v24.2,25.5 | v32.5,13.3 31.5,14.3 24.8,14.3 24.4,14.7 22.8,14.7 v22.6,14.5
  Bottom 0.254: v37.4,25 37.1,25 34.8,22.7 33.5,22.7 v32.4,21.6 34,20 v34,19.5 34.5,19 v34.5,17 | v19,9.2 19,9.1 19.7,8.4 23.2,8.4 v24.8,6.8
  Bottom 0.305: v24.2,25.5 23.2,24.5 23.2,22.8 16.67,16.27 16.67,15.73 v16.7,15.7
  Bottom 0.406: v16.7,15.7 16.7,11.5 v19,9.2
3.3V_F  (via drill 0.3)
  Top 0.254: U4.13 U4.14
  Top 0.305: U4.13 50.79,29.64 C18.1 | U4.3 47.61,24.11 v48.7,25.2 | U4.14 50.15,26.95 v50.6,26.5
  Bottom 0.254: v48.7,25.2 50,26.5 v50.6,26.5
32K_XN
  Top 0.2: C43.2 21.62,18.46 Y3.P$2 23.02,19.02 23.9,19.9 25.3,19.9 25.97,19.23 U10.13
32K_XP
  Top 0.2: C42.2 21.62,20.96 Y3.P$1 24.24,20.96 24.9,20.3 27.2,20.3 27.38,20.12 U10.12
38
  Top 0.2: U10.7 29.38,20.93 28.8,21.5 26,21.5 24.74,22.76 C30.1
39
  Top 0.2: U10.8 28.98,20.72 28.6,21.1 25.3,21.1 25.1,21.3 25.1,21.8 24.7,22.2 23.5,22.2 23.04,22.66 C30.2
BAT_MON  (via drill 0.3)
  Top 0.2: U10.5 30.18,20.93 29,22.1 v29,23
  Top 0.254: v22.2,26.8 21.2,25.8 R3.2 R2.1
  Bottom 0.2: v29,23 27.9,23 24,26.9 22.3,26.9 v22.2,26.8
CAP_10N
  Top 0.178: C31.2 C44.1 R22.2
  Top 0.2: R22.2 35,22.68 35,22.2 32.52,19.72 U10.48
CHIP_PU  (via drill 0.3)
  Top 0.2: U10.9 28.58,20.52 28.4,20.7 25.1,20.7 24.7,21.1 24.7,21.5 24.4,21.8 22.7,21.8 22.1,22.4 22.1,24.2 | 22.1,24.2 22.1,25.7 22.6,26.2 v25.9,26.2 | R21.1 22.12,24.22 22.1,24.2 | Q5.3 39.95,28.05
  Top 0.254: Q5.3 39.08,28.28 v38.9,28.3
  Bottom 0.2: 36.5,25.5 35,24 28.1,24 v25.9,26.2
  Bottom 0.254: 36.5,25.5 36.5,25.9 v38.9,28.3
CSB  (via drill 0.3)
  Top 0.2: U$1.15 34.79,10.51 34.1,11.2 v34.1,11.6 | U10.14 25.77,18.84 25.4,19.2 v24.5,19.2
  Bottom 0.2: v34.1,11.6 32.3,11.6 30.4,13.5 24.1,13.5 23.9,13.3 22.7,13.3 21.9,14.1 21.9,15.3 23.6,17 23.6,18.3 v24.5,19.2
D+
  Top 0.305: JP7.3 59.55,21.55 59.1,22 59.1,24.8 57.2,26.7 R10.1
D-
  Top 0.305: JP7.2 59.3,20.9 58.4,21.8 58.4,24.5 57.5,25.4 R9.1
DTR  (via drill 0.3)
  Top 0.2: Q5.1 42.81,28.28 R29.1
  Top 0.254: 42.81,28.28 43.22,28.28 v44.9,26.6 | U4.1 46.34,23.66 v45.7,24.3
  Bottom 0.254: v45.7,24.3 45.7,25.8 v44.9,26.6
ECG_N  (via drill 10 pad 15)
  Top 0.406: R5.1 42,10 43.1,8.9 49,8.9 v52.3,12.2
ECG_P  (via drill 0.3, 10 pad 15)
  Top 0.406: R4.1 41.9,5.9 v41.2,5.2
  Bottom 0.406: v41.2,5.2 38.1,2.1 27.1,2.1 22.3,6.9 17.9,6.9 15.4,9.4 15.4,19.5 v10.6,24.3
ECGN
  Top 0.254: U$1.7 40.61,10.51 41.55,11.45 C9.1 C3.2 43.8,10.85 R5.2
ECGP  (via drill 0.3)
  Top 0.254: U$1.6 40.99,10.01 41.2,9.8 41.2,8.9 R4.2
  Top 0.305: R4.2 v43.7,7.1 | v44.3,14.5 43.75,13.95 C10.1 C3.1
  Bottom 0.305: v44.3,14.5 43.75,13.95 43.75,8.45 v43.7,7.1
EN
  Top 0.406: U$3.4 U$3.3 21.25,5.55 23.35,3.45 S1.2
FCLK  (via drill 0.3)
  Top 0.2: v23.5,14 23.5,15.1 24.84,16.43 U10.20 | U$1.14 35.21,11.41 v35.1,11.3
  Bottom 0.2: v35.1,11.3 34.9,11.5 34.9,12 34.6,12.3 32.3,12.3 30.7,13.9 23.6,13.9 v23.5,14
FLASH_SCK  (via drill 0.3)
  Top 0.2: U10.31 29.77,12.27 29.3,11.8 28.1,11.8 v26.9,10.6 | U6.6 28.13,8.26 v27.7,8.3
  Bottom 0.2: v26.9,10.6 26.9,9.1 v27.7,8.3
FLASH_SCS
  Top 0.2: U10.30 29.38,12.57 29,12.2 27.2,12.2 25.5,10.5 24.4,10.5 24.09,10.8 U6.1
FLASH_SDI
  Top 0.2: U10.33 30.58,11.72 30.9,11.4 31.9,11.4 32.2,11.1 32.2,8.4 30.8,7 U6.5
FLASH_SDO
  Top 0.2: U10.32 30.18,11.88 29.7,11.4 28.7,11.4 26.84,9.54 U6.2
FLASH_SHD  (via drill 0.3)
  Top 0.2: U10.28 28.58,13.17 28.4,13 26.4,13 v25,11.6 | U6.7 28.63,9.54 v28.3,9.2
  Bottom 0.2: v28.3,9.2 28.3,10.3 27.2,11.4 25.2,11.4 v25,11.6
FLASH_SWP
  Top 0.2: U10.29 28.98,12.97 28.6,12.6 27.1,12.6 25.4,10.9 24.7,10.9 24.2,11.4 22.1,11.4 21.9,11.2 21.9,8.6 22.23,8.26 U6.3
FLASH_VDD
  Top 0.2: U10.26 27.77,13.57 27.6,13.4 24.57,13.4 C40.1
GND  (via drill 0.3)
  Top 0.178: 27.51,32.83 25.31,32.83
  Top 0.2: U$1.24 36.87,4.63 36.9,4.6 36.9,4.1 37,4 | U$1.26 37.87,5.23 38,5.1 | 37.9,13.8 37.9,13.4 37,12.5 37,12.2 36.87,12.07 U$1.12 36.87,10.33 36.9,10.3
  Top 0.254: 36.87,8.51 U$1.THERMAL | U$1.28 38.87,7.51 37.87,8.51 | U$1.5 40.59,9.51 40.7,9.4 | Y2.2 35.75,16.45 37.01,15.19 C5.2 38.16,14.99 C2.2
  Top 0.305: C20.2 20.05,5.85 19.1,4.9
  Top 0.762: E2.GND 27.51,32.83 | 25.31,32.83 E2.GND2
  other vias: 42.9,4.31 28.3,17.04 28.3,18.3 29.58,18.3 30.84,17.04 30.84,15.76 29.58,15.76 28.3,15.76 25.13,33.04 23.86,33.04 22.59,33.04 21.32,33.04 20.05,33.04 18.78,33.04 26.4,33.04 27.67,33.04 29.7,33.04 30.97,33.04 32.24,33.04 33.51,33.04 34.78,33.04 36.05,33.04 37.32,33.04 38.59,33.04 41.13,33.04 42.4,33.04 28.05,32.12 30.46,32.12 29.07,29.99 31.61,29.99 30.97,30.88 29.32,28.72 31.48,28.72 29.32,27.45 31.48,27.45 31.58,26.18 31.48,24.91 30.36,23.14 28.05,28.72 28.05,27.45 28.05,29.89 26.4,31.77 25.13,31.77 23.86,31.77 31.73,32.02 32.24,30.88 32.88,29.99 32.75,28.72 32.75,27.45 32.75,26.18 33.51,31.77 34.78,31.77 36.05,31.77 37.32,31.77 38.59,31.77 29.58,17.04 18.26,19.33 27.27,26.02 18.1,4.6 40.1,11.6 40.3,18.2 44.8,15.8 50.3,20.7 31.2,8.4 20.8,12.1 17.5,18.4 19.6,16.2 45.1,7.7 34.3,14 37.4,9 28.3,7.4 6.9,7.8 12,3.6 16.2,3.9 38.4,4.7 39.9,6.2 37,3.2 30.84,18.3 22.5,19.7 9.5,7.1 21.2,13.7 14.4,7.9 40,20.9 44,18.3 55,28.9 22.1,5.9
  pour Bottom (isolate 0.305, rank 6): 65.6,0 0,0.1 0,33.43 65.6,33.43
  pour Top (isolate 0.305, rank 6): 0,0.1 65.6,0 65.6,33.43 43.73,33.43 43.7,33.4 43.6,33.4 43.58,33.43 43.33,33.43 43.3,33.4 0,33.43
INT2B  (via drill 0.3)
  Top 0.2: U$1.20 34.31,8.01 34.1,7.8 34.1,7.2 v33.8,6.9 | U10.15 25.23,18.43 v25.2,18.4
  Bottom 0.2: v33.8,6.9 33.2,6.3 31.1,6.3 30.2,7.2 30.1,7.2 30.1,10.6 28.7,12 25.8,12 25.5,12.3 24.6,12.3 24.3,12 22.1,12 21.2,12.9 20.8,12.9 20.5,13.2 20.5,14.5 23.1,17.1 23.1,19.1 23.9,19.9 24.8,19.9 25.2,19.5 v25.2,18.4
INTB  (via drill 0.3)
  Top 0.2: U10.16 25.84,18.04 25.5,17.7 24.2,17.7 24.1,17.6 22,17.6 21.7,17.9 20.2,17.9 v19.9,17.6
  Top 0.254: U$1.21 34.97,6.07 v33.9,5
  Bottom 0.2: v33.9,5 28.6,5 23.7,9.9 21.1,9.9 18.3,12.7 18.3,16 v19.9,17.6
LNA_IN
  Top 0.178: L3.1 30.41,25.94 | U10.2 31.38,21.31
  Top 0.762: L3.1 30.43,24.48 31.38,23.53 31.38,21.31 | 30.41,25.94 C34.1
MISO  (via drill 0.3)
  Top 0.2: U$1.18 34.11,9.01 32.4,7.3 v32.4,7 | U10.38 33.16,15.23 33.3,15.1 v33.3,13.9
  Bottom 0.2: v33.3,13.9 33.3,13.1 33.6,12.8 34.8,12.8 36,11.6 36,10.6 v32.4,7
MOSI  (via drill 0.3)
  Top 0.2: U10.36 31.77,12.72 31.9,12.6 32.6,12.6 33.4,11.8 33.4,10.9 v33.7,10.6 | U$1.17 33.61,9.51 v33.3,9.2
  Bottom 0.2: v33.7,10.6 33.7,9.6 v33.3,9.2
N$1  (via drill 0.3)
  Top 0.254: LED1.4-DIN 13.45,4.45 v13.4,4.5 | R1.1 15.6,16.9 v14.2,15.5
  Bottom 0.254: v13.4,4.5 13.4,11.3 12.2,12.5 12.2,13.5 v14.2,15.5
N$2
  Top 0.2: U$1.23 36.37,3.94 C6.1
N$3
  Top 0.2: U$1.9 38.37,12.07 38.8,12.5 40.02,12.5
  Top 0.254: 40.02,12.5 C1.1
N$4
  Top 0.2: U10.24 25.54,14.83 TP2.TP
N$5
  Top 0.305: U5.1 8.1,6.65 CHG1.C
N$6
  Top 0.2: U$1.10 37.87,12.17 38.8,13.1 39.5,13.1 39.7,13.3 39.7,14 40.49,14.79 C1.2
  Top 0.254: C1.2 40.29,14.79
N$7
  Top 0.2: U$1.11 37.37,12.27 38.86,13.76 C2.1
N$9
  Top 0.305: R9.2 53,25.4 51.42,26.98 U4.12
N$11
  Top 0.305: R10.2 52.8,26.7 52.06,27.44 U4.11
N$13
  Top 0.2: U$1.25 37.37,4.73 38.39,3.71 C7.1
N$14
  Top 0.254: U$1.27 38.37,5.83 40.44,3.76 C8.1
N$16
  Top 0.305: R18.2 11.95,5.7 CHG1.A
N$19
  Top 0.305: R19.2 5.65,11.9 U5.5
N$23
  Top 0.2: Q5.5 40.6,26.7 41,27.1 42.37,27.1 R29.2
N$24
  Top 0.254: Q5.2 40.6,29 40.3,29.3 38.47,29.3 R30.2
N$25
  Top 0.2: U10.45 33.73,18.04 34.65,18.95 Y2.1 35.75,20.38 C27.2
N$26
  Top 0.2: U10.44 33.94,17.63 34.3,18 36.09,18 Y2.3
  Top 0.254: Y2.3 38.3,16.59 C28.2
N$30
  Top 0.178: R22.1 C44.2
  Top 0.2: U10.47 33.04,18.84 33.3,19.1 33.3,19.8 35.4,21.9 R22.1
RTS  (via drill 0.3)
  Top 0.254: R30.1 37.63,26.44 Q5.4 39.95,26.65 v39.3,27.3
  Top 0.305: U4.2 46.98,24.52 v46.9,24.6
  Bottom 0.254: v46.9,24.6 46.9,26.7 45.2,28.4 40.4,28.4 v39.3,27.3
RXD
  Top 0.254: R13.2 46.6,19.6 48.25,21.25 U4.4
SCLK
  Top 0.2: U10.35 31.38,12.32 31.5,12.2 32.4,12.2 33,11.6 33,10.2 33.3,9.9 34.1,9.9 34.21,10.01 U$1.16
TRACE_ANT1
  Top 0.178: E2.ANT 28.69,33.22
  Top 0.762: 28.69,33.22 arc46 29.22,32.05 arc-35 C33.1 arc33 30.26,29.99 arc-37 30.39,29.68 30.39,29.34 C34.2
TXD
  Top 0.254: U4.20 46.34,26.29 R12.2
U0RXD  (via drill 0.3)
  Top 0.2: U10.40 33.87,16.04 35.3,14.6 v35.3,14.3 | R12.1 v43,20.1
  Bottom 0.2: v43,20.1 43,17.4 40.1,14.5 36.4,14.5 36.2,14.3 v35.3,14.3
U0TXD  (via drill 0.3)
  Top 0.2: U10.41 34.07,16.43 35.4,15.1 v35.9,15.1
  Top 0.254: R13.1 43.6,19.6 v42.1,18.1
  Bottom 0.2: v42.1,18.1 39,15 36,15 v35.9,15.1
VBAT  (via drill 0.3)
  Top 0.254: R2.2 19.45,22.65 18.5,21.7 18.5,20.7 14.5,16.7 13.8,16.7 v12.2,15.1
  Top 0.305: Q3.3 9.95,10.7 C22.1
  Top 0.406: U5.3 10.05,13.95 11.2,12.8 v11.2,12.1 11.2,10.8 Q3.3
  Bottom 0.254: v12.2,15.1 11,13.9 11,12.3 v11.2,12.1
  Bottom 0.406: TP4.TP v11.2,12.1
VIN  (via drill 0.3)
  Top 0.305: U$3.5 20.3,11.5 C16.1 15.75,12.5 D3.C
  Top 0.406: C19.1 D3.C 13.5,11.75 Q3.2 13.4,13.4 v13.3,13.5 | S1.3 22.15,3.45 v22.5,3.1
  Bottom 0.406: v13.3,13.5 14.6,12.2 14.6,9 17.6,6 19.6,6 v22.5,3.1
VUSB  (via drill 0.3)
  Top 0.254: U5.4 C12.1
  Top 0.305: C17.1 49.52,30.13 U4.15 49.52,26.28 v51.3,24.5 54.2,24.5 55.4,23.3 | R18.1 R20.2
  Top 0.406: Q3.1 14.9,9.75 D3.A 16.25,9.45 v16.5,9.7 | JP7.1 58,20.25 C21.1 56.95,21.75 55.4,23.3 | Q3.1 13.4,8.25 R20.2 | Q3.1 13.4,9.8 12.4,10.8 12.4,12.9 10.4,14.9 6.45,14.9 U5.4
  Bottom 0.406: v51.3,24.5 51.3,23.8 41,13.5 41,9 35.9,3.9 30.3,3.9 29.4,3 28.3,3 25.5,5.8 24.5,5.8 22.5,7.8 18.4,7.8 v16.5,9.7
WS2812/GPIO14
  Top 0.2: U10.17 26.04,17.63 25.7,17.3 24.4,17.3 24.1,17 20.5,17 20.4,16.9 R1.2 17.75,16.6

### Text on the board
tPlace: v2 | R19 | + | CHG | GP5 | ON
bPlace: protocentral.com